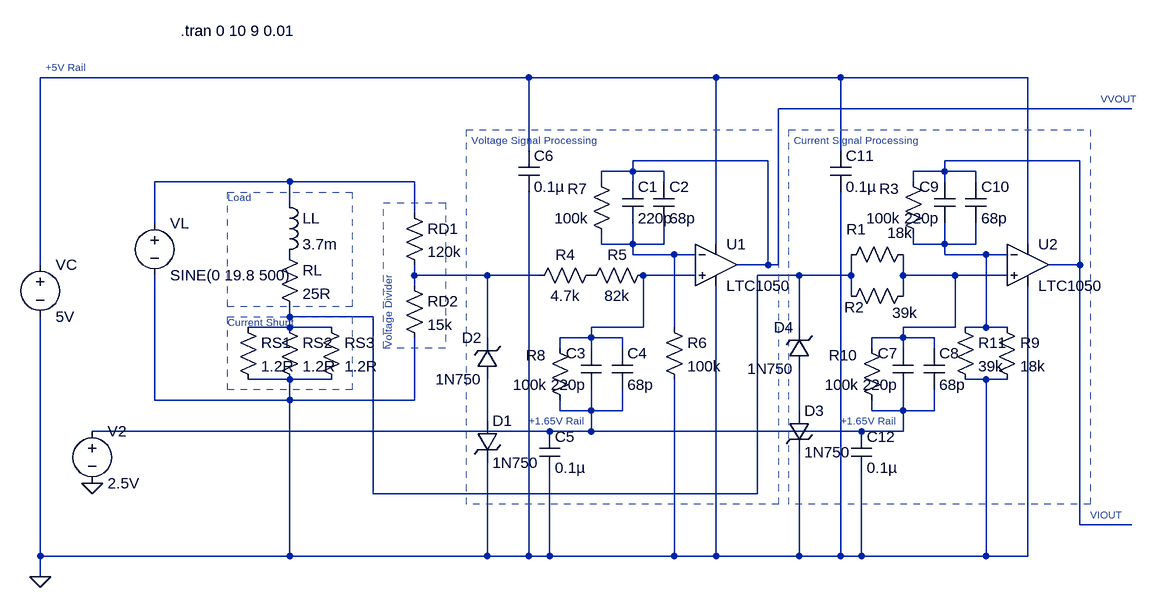
[diagram p0: schematic 5V Monitor Design.asc]
5V Monitor Design.asc, the LTspice schematic file:
Version 4
SHEET 1 2372 3036
WIRE 480 -96 -272 -96
WIRE 768 -96 480 -96
WIRE 960 -96 768 -96
WIRE 1248 -96 960 -96
WIRE 1408 -48 864 -48
WIRE 480 16 480 -96
WIRE 960 16 960 -96
WIRE 848 32 640 32
WIRE 1328 32 1120 32
WIRE 640 48 640 32
WIRE 640 48 592 48
WIRE 688 48 640 48
WIRE 1120 48 1120 32
WIRE 1120 48 1072 48
WIRE 1168 48 1120 48
WIRE 112 64 -96 64
WIRE 304 64 112 64
WIRE 592 64 592 48
WIRE 640 64 640 48
WIRE 688 64 688 48
WIRE 1072 64 1072 48
WIRE 1120 64 1120 48
WIRE 1168 64 1168 48
WIRE 112 96 112 64
WIRE 304 112 304 64
WIRE -96 128 -96 64
WIRE 592 160 592 144
WIRE 640 160 640 128
WIRE 640 160 592 160
WIRE 688 160 688 128
WIRE 688 160 640 160
WIRE 768 160 768 -96
WIRE 1072 160 1072 144
WIRE 1120 160 1120 128
WIRE 1120 160 1072 160
WIRE 1168 160 1168 128
WIRE 1168 160 1120 160
WIRE 1248 160 1248 -96
WIRE 640 176 640 160
WIRE 704 176 640 176
WIRE 736 176 704 176
WIRE 1120 176 1120 160
WIRE 1184 176 1120 176
WIRE 1216 176 1184 176
WIRE -272 192 -272 -96
WIRE 848 192 848 32
WIRE 848 192 800 192
WIRE 864 192 864 -48
WIRE 864 192 848 192
WIRE 1328 192 1328 32
WIRE 1328 192 1280 192
WIRE 304 208 304 192
WIRE 416 208 304 208
WIRE 496 208 416 208
WIRE 736 208 656 208
WIRE 896 208 832 208
WIRE 976 208 976 176
WIRE 976 208 896 208
WIRE 1056 208 1056 176
WIRE 1136 208 1056 208
WIRE 1216 208 1136 208
WIRE 304 224 304 208
WIRE 976 240 976 208
WIRE 1056 240 1056 208
WIRE 112 272 112 256
WIRE 240 272 112 272
WIRE 112 288 112 272
WIRE 112 288 48 288
WIRE 176 288 112 288
WIRE 656 288 656 208
WIRE 656 288 576 288
WIRE 704 288 704 176
WIRE 896 288 896 208
WIRE 1136 288 1136 208
WIRE 1136 288 1056 288
WIRE 1184 288 1184 176
WIRE 1184 288 1152 288
WIRE 1216 288 1184 288
WIRE 416 304 416 208
WIRE 576 304 576 288
WIRE 576 304 528 304
WIRE 624 304 576 304
WIRE 1056 304 1056 288
WIRE 1056 304 1008 304
WIRE 1104 304 1056 304
WIRE 528 320 528 304
WIRE 576 320 576 304
WIRE 624 320 624 304
WIRE 1008 320 1008 304
WIRE 1056 320 1056 304
WIRE 1104 320 1104 304
WIRE 112 368 48 368
WIRE 176 368 112 368
WIRE 1184 368 1152 368
WIRE 1216 368 1184 368
WIRE -96 400 -96 208
WIRE 112 400 112 368
WIRE 112 400 -96 400
WIRE 304 400 304 304
WIRE 304 400 112 400
WIRE 528 416 528 400
WIRE 576 416 576 384
WIRE 576 416 528 416
WIRE 624 416 624 384
WIRE 624 416 576 416
WIRE 896 416 896 352
WIRE 1008 416 1008 400
WIRE 1056 416 1056 384
WIRE 1056 416 1008 416
WIRE 1104 416 1104 384
WIRE 1104 416 1056 416
WIRE 416 432 416 368
WIRE 512 448 -192 448
WIRE 576 448 576 416
WIRE 576 448 512 448
WIRE 992 448 576 448
WIRE 1056 448 1056 416
WIRE 1056 448 992 448
WIRE 240 544 240 272
WIRE 832 544 832 208
WIRE 832 544 240 544
WIRE 1328 592 1328 192
WIRE 1408 592 1328 592
WIRE -272 640 -272 272
WIRE 112 640 112 400
WIRE 112 640 -272 640
WIRE 416 640 416 496
WIRE 416 640 112 640
WIRE 480 640 480 80
WIRE 480 640 416 640
WIRE 512 640 512 512
WIRE 512 640 480 640
WIRE 704 640 704 368
WIRE 704 640 512 640
WIRE 768 640 768 224
WIRE 768 640 704 640
WIRE 896 640 896 480
WIRE 896 640 768 640
WIRE 960 640 960 80
WIRE 960 640 896 640
WIRE 992 640 992 512
WIRE 992 640 960 640
WIRE 1184 640 1184 368
WIRE 1184 640 992 640
WIRE 1248 640 1248 224
WIRE 1248 640 1184 640
WIRE -272 672 -272 640
FLAG -272 672 0
FLAG -192 528 0
SYMBOL voltage -96 112 R0
WINDOW 123 0 0 Left 2
WINDOW 39 0 0 Left 2
SYMATTR InstName VL
SYMATTR Value SINE(0 19.8 500)
SYMBOL res 96 160 R0
SYMATTR InstName RL
SYMATTR Value 25R
SYMBOL ind 96 80 R0
SYMATTR InstName LL
SYMATTR Value 3.7m
SYMBOL res 32 272 R0
SYMATTR InstName RS1
SYMATTR Value 1.2R
SYMBOL res 96 272 R0
SYMATTR InstName RS2
SYMATTR Value 1.2R
SYMBOL res 160 272 R0
SYMATTR InstName RS3
SYMATTR Value 1.2R
SYMBOL voltage -272 176 R0
WINDOW 123 0 0 Left 2
WINDOW 39 0 0 Left 2
SYMATTR InstName VC
SYMATTR Value 5V
SYMBOL res 288 96 R0
SYMATTR InstName RD1
SYMATTR Value 120k
SYMBOL res 288 208 R0
SYMATTR InstName RD2
SYMATTR Value 15k
SYMBOL cap 624 64 R0
SYMATTR InstName C1
SYMATTR Value 220p
SYMBOL cap 672 64 R0
SYMATTR InstName C2
SYMATTR Value 68p
SYMBOL res 608 160 R180
WINDOW 0 38 85 Left 2
WINDOW 3 36 40 Left 2
SYMATTR InstName R7
SYMATTR Value 100k
SYMBOL res 688 272 R0
SYMATTR InstName R6
SYMATTR Value 100k
SYMBOL cap 592 384 R180
WINDOW 0 24 56 Left 2
WINDOW 3 24 8 Left 2
SYMATTR InstName C3
SYMATTR Value 220p
SYMBOL cap 608 320 R0
SYMATTR InstName C4
SYMATTR Value 68p
SYMBOL res 544 416 R180
WINDOW 0 38 85 Left 2
WINDOW 3 36 40 Left 2
SYMATTR InstName R8
SYMATTR Value 100k
SYMBOL cap 496 448 R0
SYMATTR InstName C5
SYMATTR Value 0.1µ
SYMBOL cap 464 16 R0
SYMATTR InstName C6
SYMATTR Value 0.1µ
SYMBOL zener 400 432 R0
SYMATTR InstName D1
SYMATTR Value 1N750
SYMBOL zener 432 368 R180
WINDOW 0 24 64 Left 2
WINDOW 3 24 0 Left 2
SYMATTR InstName D2
SYMATTR Value 1N750
SYMBOL res 1088 160 R180
WINDOW 0 38 85 Left 2
WINDOW 3 36 40 Left 2
SYMATTR InstName R3
SYMATTR Value 100k
SYMBOL res 1024 416 R180
WINDOW 0 38 85 Left 2
WINDOW 3 36 40 Left 2
SYMATTR InstName R10
SYMATTR Value 100k
SYMBOL cap 944 16 R0
SYMATTR InstName C11
SYMATTR Value 0.1µ
SYMBOL voltage -192 432 R0
SYMATTR InstName V2
SYMATTR Value 2.5V
SYMBOL cap 976 448 R0
SYMATTR InstName C12
SYMATTR Value 0.1µ
SYMBOL zener 880 416 R0
SYMATTR InstName D3
SYMATTR Value 1N750
SYMBOL zener 912 352 R180
WINDOW 0 24 64 Left 2
WINDOW 3 24 0 Left 2
SYMATTR InstName D4
SYMATTR Value 1N750
SYMBOL res 1072 160 R90
WINDOW 0 -7 88 VBottom 2
WINDOW 3 -33 21 VTop 2
SYMATTR InstName R1
SYMATTR Value 18k
SYMBOL res 1072 224 R90
WINDOW 0 49 91 VBottom 2
WINDOW 3 26 13 VTop 2
SYMATTR InstName R2
SYMATTR Value 39k
SYMBOL res 1200 272 R0
SYMATTR InstName R9
SYMATTR Value 18k
SYMBOL res 1136 272 R0
SYMATTR InstName R11
SYMATTR Value 39k
SYMBOL cap 1072 384 R180
WINDOW 0 24 56 Left 2
WINDOW 3 24 8 Left 2
SYMATTR InstName C7
SYMATTR Value 220p
SYMBOL cap 1088 320 R0
SYMATTR InstName C8
SYMATTR Value 68p
SYMBOL cap 1136 128 R180
WINDOW 0 24 56 Left 2
WINDOW 3 24 8 Left 2
SYMATTR InstName C9
SYMATTR Value 220p
SYMBOL cap 1152 64 R0
SYMATTR InstName C10
SYMATTR Value 68p
SYMBOL res 592 192 R90
WINDOW 0 0 56 VBottom 2
WINDOW 3 32 56 VTop 2
SYMATTR InstName R4
SYMATTR Value 4.7k
SYMBOL res 672 192 R90
WINDOW 0 0 56 VBottom 2
WINDOW 3 32 56 VTop 2
SYMATTR InstName R5
SYMATTR Value 82k
SYMBOL Opamps\\LTC1050 768 128 R0
SYMATTR InstName U1
SYMBOL Opamps\\LTC1050 1248 128 R0
SYMATTR InstName U2
TEXT 16 280 Left 1 ;Current Shunt
TEXT 16 88 Left 1 ;Load
TEXT 264 320 VLeft 1 ;Voltage Divider
TEXT -264 -112 Left 1 ;+5V Rail
TEXT 480 432 Left 1 ;+1.65V Rail
TEXT -56 -168 Left 2 !.tran 0 10 9 0.01
TEXT 960 432 Left 1 ;+1.65V Rail
TEXT 392 0 Left 1 ;Voltage Signal Processing
TEXT 888 0 Left 1 ;Current Signal Processing
TEXT 1360 -64 Left 1 ;VVOUT
TEXT 1344 576 Left 1 ;VIOUT
RECTANGLE Normal 208 384 16 272 2
RECTANGLE Normal 208 256 16 80 2
RECTANGLE Normal 352 320 256 96 2
RECTANGLE Normal 864 560 384 -16 2
RECTANGLE Normal 1344 560 880 -16 2

The netlist it stands for:
* 5V Monitor Design.asc
VL N004 0 SINE(0 19.8 500)
RL P001 N009 25R
LL N004 P001 3.7m
RS1 N009 0 1.2R
RS2 N009 0 1.2R
RS3 N009 0 1.2R
VC N001 0 5V
RD1 N004 N007 120k
RD2 N007 0 15k
C1 N002 N005 220p
C2 N002 N005 68p
R7 N005 N002 100k
R6 N005 0 100k
C3 N011 N008 220p
C4 N008 N011 68p
R8 N011 N008 100k
C5 N011 0 0.1µ
C6 N001 0 0.1µ
D1 N013 0 1N750
D2 N013 N007 1N750
R3 N006 N003 100k
R10 N011 N010 100k
C11 N001 0 0.1µ
V2 N011 0 2.5V
C12 N011 0 0.1µ
D3 N012 0 1N750
D4 N012 N009 1N750
R1 N010 N009 18k
R2 N010 N009 39k
R9 N006 0 18k
R11 N006 0 39k
C7 N011 N010 220p
C8 N010 N011 68p
C9 N006 N003 220p
C10 N003 N006 68p
R4 P002 N007 4.7k
R5 N008 P002 82k
XU1 N008 N005 N001 0 N002 LTC1050  ; pins In+ In- V+ V- OUT
XU2 N010 N006 N001 0 N003 LTC1050  ; pins In+ In- V+ V- OUT
.model D D
.lib standard.dio
* Current Shunt
* Load
* Voltage Divider
* +5V Rail
* +1.65V Rail
.tran 0 10 9 0.01
* +1.65V Rail
* Voltage Signal Processing
* Current Signal Processing
* VVOUT
* VIOUT
.lib LTC.lib
.backanno
.end